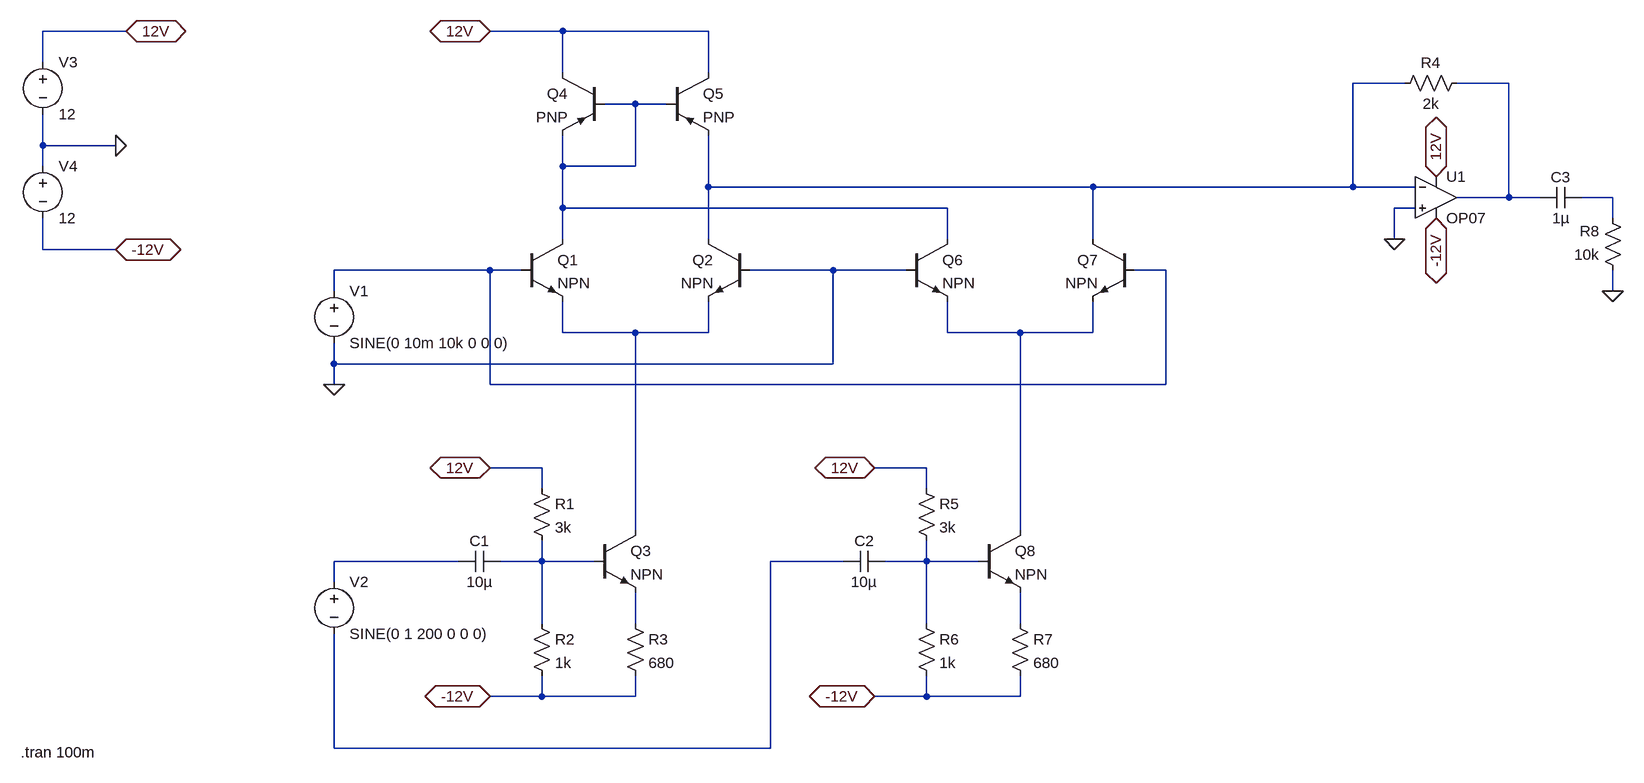
[diagram p0: schematic gilbert_cell.asc]
gilbert_cell.asc, the LTspice schematic file:
Version 4
SHEET 1 1556 948
WIRE -752 -224 -880 -224
WIRE -80 -224 -192 -224
WIRE 144 -224 -80 -224
WIRE -880 -176 -880 -224
WIRE -80 -160 -80 -224
WIRE 144 -160 144 -224
WIRE 1216 -144 1136 -144
WIRE 1376 -144 1296 -144
WIRE 32 -112 -16 -112
WIRE 80 -112 32 -112
WIRE -880 -48 -880 -96
WIRE -768 -48 -880 -48
WIRE -880 -16 -880 -48
WIRE -80 -16 -80 -64
WIRE 32 -16 32 -112
WIRE 32 -16 -80 -16
WIRE 144 16 144 -64
WIRE 736 16 144 16
WIRE 1136 16 1136 -144
WIRE 1136 16 736 16
WIRE 1232 16 1136 16
WIRE 1376 32 1376 -144
WIRE 1376 32 1296 32
WIRE 1424 32 1376 32
WIRE 1536 32 1488 32
WIRE -80 48 -80 -16
WIRE 512 48 -80 48
WIRE 1232 48 1200 48
WIRE 1536 64 1536 32
WIRE -80 96 -80 48
WIRE 144 96 144 16
WIRE 512 96 512 48
WIRE 736 96 736 16
WIRE 1200 96 1200 48
WIRE -880 112 -880 64
WIRE -768 112 -880 112
WIRE -192 144 -432 144
WIRE -144 144 -192 144
WIRE 336 144 208 144
WIRE 448 144 336 144
WIRE 848 144 800 144
WIRE -432 176 -432 144
WIRE 1536 176 1536 144
WIRE -80 240 -80 192
WIRE 32 240 -80 240
WIRE 144 240 144 192
WIRE 144 240 32 240
WIRE 512 240 512 192
WIRE 624 240 512 240
WIRE 736 240 736 192
WIRE 736 240 624 240
WIRE -432 288 -432 256
WIRE 336 288 336 144
WIRE 336 288 -432 288
WIRE -432 320 -432 288
WIRE -192 320 -192 144
WIRE 848 320 848 144
WIRE 848 320 -192 320
WIRE -112 448 -192 448
WIRE 480 448 400 448
WIRE -112 480 -112 448
WIRE 480 480 480 448
WIRE 32 544 32 240
WIRE 624 544 624 240
WIRE -240 592 -432 592
WIRE -112 592 -112 560
WIRE -112 592 -176 592
WIRE -32 592 -112 592
WIRE 352 592 240 592
WIRE 480 592 480 560
WIRE 480 592 416 592
WIRE 560 592 480 592
WIRE -432 624 -432 592
WIRE -112 688 -112 592
WIRE 32 688 32 640
WIRE 480 688 480 592
WIRE 624 688 624 640
WIRE -112 800 -112 768
WIRE -112 800 -192 800
WIRE 32 800 32 768
WIRE 32 800 -112 800
WIRE 480 800 480 768
WIRE 480 800 400 800
WIRE 624 800 624 768
WIRE 624 800 480 800
WIRE -432 880 -432 704
WIRE 240 880 240 592
WIRE 240 880 -432 880
FLAG -192 448 12V
IOPIN -192 448 BiDir
FLAG -192 800 -12V
IOPIN -192 800 BiDir
FLAG -192 -224 12V
IOPIN -192 -224 BiDir
FLAG 1200 96 0
FLAG 1264 0 12V
IOPIN 1264 0 BiDir
FLAG 1264 64 -12V
IOPIN 1264 64 BiDir
FLAG 400 448 12V
IOPIN 400 448 BiDir
FLAG 400 800 -12V
IOPIN 400 800 BiDir
FLAG -752 -224 12V
IOPIN -752 -224 BiDir
FLAG -768 112 -12V
IOPIN -768 112 BiDir
FLAG -768 -48 0
FLAG 1536 176 0
FLAG -432 320 0
SYMBOL npn -144 96 R0
SYMATTR InstName Q1
SYMBOL npn 208 96 M0
SYMATTR InstName Q2
SYMBOL npn -32 544 R0
SYMATTR InstName Q3
SYMBOL res -128 464 R0
SYMATTR InstName R1
SYMATTR Value 3k
SYMBOL res -128 672 R0
SYMATTR InstName R2
SYMATTR Value 1k
SYMBOL res 16 672 R0
SYMATTR InstName R3
SYMATTR Value 680
SYMBOL cap -176 576 R90
WINDOW 0 0 32 VBottom 2
WINDOW 3 32 32 VTop 2
SYMATTR InstName C1
SYMATTR Value 10µ
SYMBOL pnp -16 -160 M0
SYMATTR InstName Q4
SYMBOL pnp 80 -160 R0
SYMATTR InstName Q5
SYMBOL OpAmps\\OP07 1264 -32 R0
SYMATTR InstName U1
SYMBOL res 1312 -160 R90
WINDOW 0 0 56 VBottom 2
WINDOW 3 32 56 VTop 2
SYMATTR InstName R4
SYMATTR Value 2k
SYMBOL npn 448 96 R0
SYMATTR InstName Q6
SYMBOL npn 800 96 M0
SYMATTR InstName Q7
SYMBOL npn 560 544 R0
SYMATTR InstName Q8
SYMBOL res 464 464 R0
SYMATTR InstName R5
SYMATTR Value 3k
SYMBOL res 464 672 R0
SYMATTR InstName R6
SYMATTR Value 1k
SYMBOL res 608 672 R0
SYMATTR InstName R7
SYMATTR Value 680
SYMBOL cap 416 576 R90
WINDOW 0 0 32 VBottom 2
WINDOW 3 32 32 VTop 2
SYMATTR InstName C2
SYMATTR Value 10µ
SYMBOL voltage -432 160 R0
WINDOW 123 0 0 Left 0
WINDOW 39 0 0 Left 0
SYMATTR InstName V1
SYMATTR Value SINE(0 10m 10k 0 0 0)
SYMBOL voltage -432 608 R0
WINDOW 123 0 0 Left 0
WINDOW 39 0 0 Left 0
SYMATTR InstName V2
SYMATTR Value SINE(0 1 200 0 0 0)
SYMBOL voltage -880 -192 R0
WINDOW 123 0 0 Left 0
WINDOW 39 0 0 Left 0
SYMATTR InstName V3
SYMATTR Value 12
SYMBOL voltage -880 -32 R0
WINDOW 123 0 0 Left 0
WINDOW 39 0 0 Left 0
SYMATTR InstName V4
SYMATTR Value 12
SYMBOL cap 1488 16 R90
WINDOW 0 0 32 VBottom 2
WINDOW 3 32 32 VTop 2
SYMATTR InstName C3
SYMATTR Value 1µ
SYMBOL res 1552 160 R180
WINDOW 0 36 76 Left 2
WINDOW 3 36 40 Left 2
SYMATTR InstName R8
SYMATTR Value 10k
TEXT -914 886 Left 2 !.tran 100m

The netlist it stands for:
* gilbert_cell.asc
Q1 N003 N005 N006 0 NPN
Q2 N001 0 N006 0 NPN
Q3 N006 N009 N012 0 NPN
R1 12V N009 3k
R2 N009 -12V 1k
R3 N012 -12V 680
C1 N009 N008 10µ
Q4 12V N003 N003 0 PNP
Q5 12V N003 N001 0 PNP
XU1 0 N001 12V -12V N002 LT1001  ; OP07, pins In+ In- V+ V- OUT
R4 N002 N001 2k
Q6 N003 0 N007 0 NPN
Q7 N001 N005 N007 0 NPN
Q8 N007 N011 N013 0 NPN
R5 12V N011 3k
R6 N011 -12V 1k
R7 N013 -12V 680
C2 N011 N010 10µ
V1 N005 0 SINE(0 10m 10k 0 0 0)
V2 N008 N010 SINE(0 1 200 0 0 0)
V3 12V 0 12
V4 0 -12V 12
C3 N004 N002 1µ
R8 0 N004 10k
.model NPN NPN
.model PNP PNP
.lib standard.bjt
.tran 100m
.lib LTC.lib
.backanno
.end